# EAGLE schematic schematic (EAGLE 6.6.0)
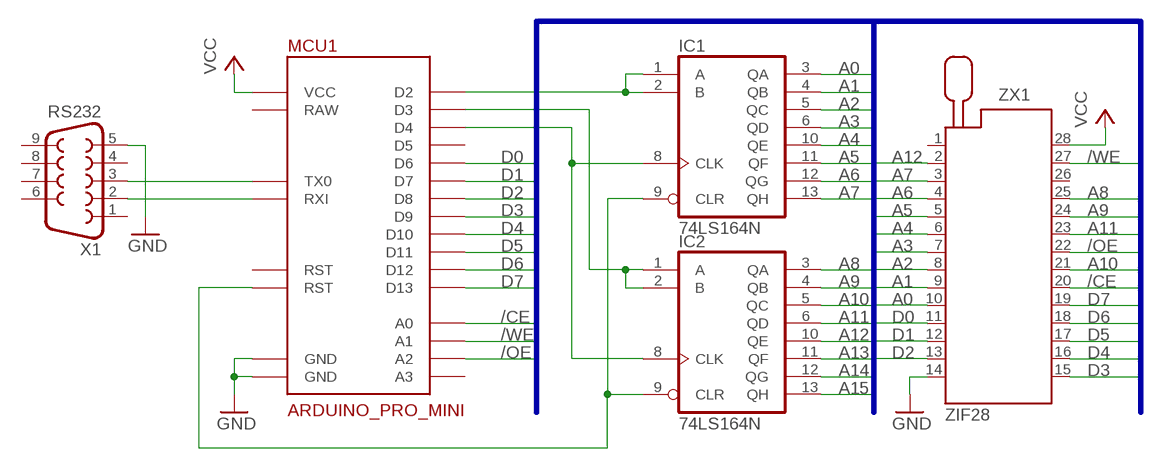
[diagram p0: schematic, sheet 1]

## Parts
IC1  74LS164N  [DIL14]
IC2  74LS164N  [DIL14]
MCU1  ARDUINO_PRO_MINI  ARDUINOPROMINI  [PDIP-26]
X1  RS232  F09H  [F09H]
ZX1  ZIF28  228-1277-00-0602J  [228-1277-00-0602J]

## Nets
/CE: MCU1.A0 ZX1.20
/OE: MCU1.A2 ZX1.22
/WE: MCU1.A1 ZX1.27
A0: IC1.3(QA) ZX1.10
A1: IC1.4(QB) ZX1.9
A2: IC1.5(QC) ZX1.8
A3: IC1.6(QD) ZX1.7
A4: IC1.10(QE) ZX1.6
A5: IC1.11(QF) ZX1.5
A6: IC1.12(QG) ZX1.4
A7: IC1.13(QH) ZX1.3
A8: IC2.3(QA) ZX1.25
A9: IC2.4(QB) ZX1.24
A10: IC2.5(QC) ZX1.21
A11: IC2.6(QD) ZX1.23
A12: IC2.10(QE) ZX1.2
A13: IC2.11(QF)
A14: IC2.12(QG)
A15: IC2.13(QH)
D0: MCU1.D6 ZX1.11
D1: MCU1.D7 ZX1.12
D2: MCU1.D8 ZX1.13
D3: MCU1.D9 ZX1.15
D4: MCU1.D10 ZX1.16
D5: MCU1.D11 ZX1.17
D6: MCU1.D12 ZX1.18
D7: MCU1.D13 ZX1.19
GND: MCU1.GND MCU1.GND0(GND) X1.5 ZX1.14
N$1: IC1.8(CLK) IC2.8(CLK) MCU1.D4
N$2: IC1.9(CLR) IC2.9(CLR) MCU1.RST
N$3: IC1.1(A) IC1.2(B) MCU1.D2
N$4: IC2.1(A) IC2.2(B) MCU1.D3
N$29: MCU1.RXI X1.2
N$31: MCU1.TXO(TX0) X1.3
VCC: MCU1.VCC ZX1.28
Unconnected: MCU1.A3 MCU1.D5 MCU1.RST0(RST) X1.1 X1.4 X1.6 X1.7 X1.8 X1.9 ZX1.1 ZX1.26

## Buses
A[0..18],D[0..7],/CE,/WE,/OE

## Power pins joined to a net without a drawn wire
GND: IC1.7(GND) IC2.7(GND)
RAW: MCU1.RAW
VCC: IC1.14(VCC) IC2.14(VCC)

## Library data of the parts
IC1 IC2 = 74xx-eu:74*164: 8-bit parallel out SHIFT REGISTER
MCU1 = Arduino-ProMini:ARDUINOPROMINI
X1 = con-subd:F09: SUB-D; OC_FARNELL: unknown; OC_NEWARK: unknown
ZX1 = con-3m:228-?00-0602J: Zero Insertion Force Socked Source: http://www.3M.com/ehpd; MF: 3M; MPN: 228-1277-00-0602J; OC_FARNELL: 9897356; OC_NEWARK: 85K7825